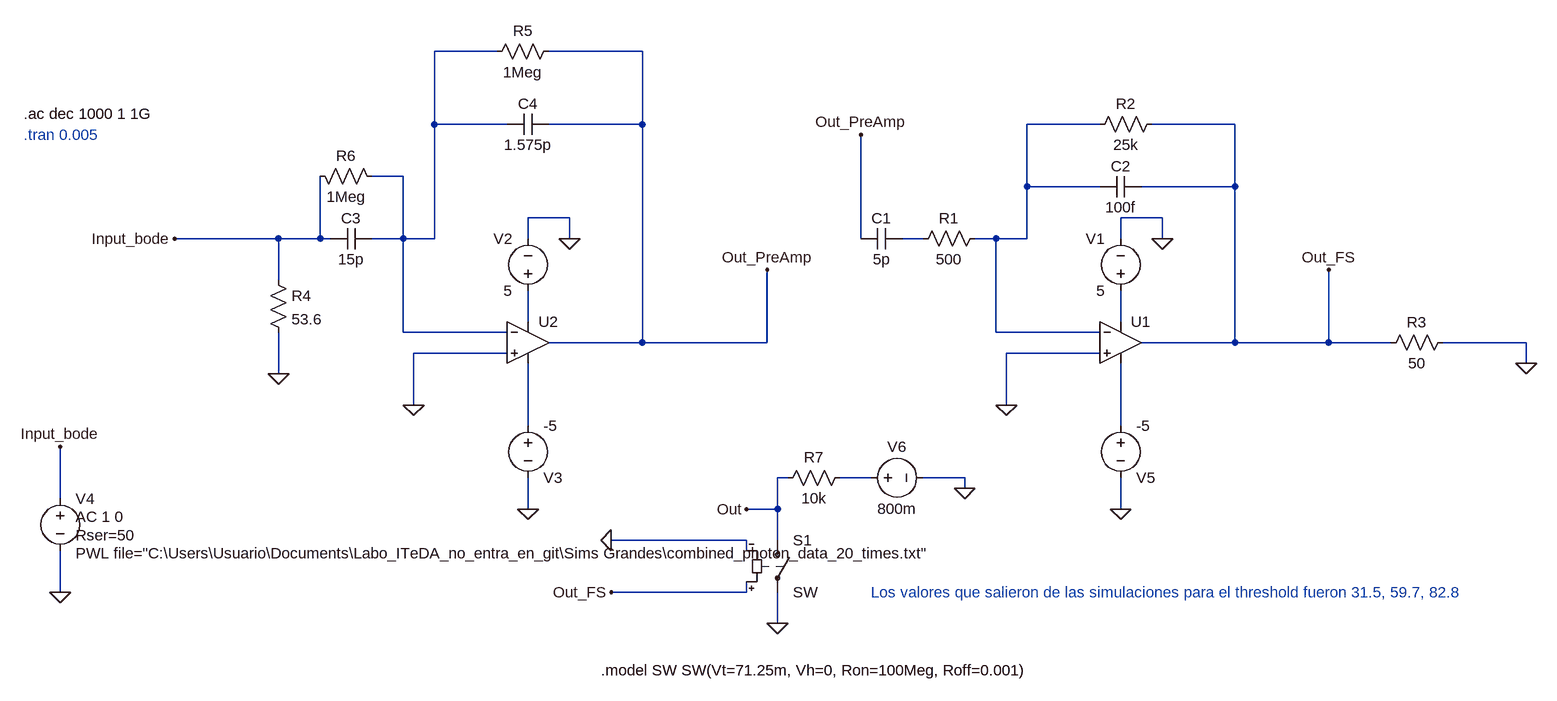
[diagram p0: schematic bode_circuito_completo_con_capacitores_en_preamp_inversor_v1,5.asc]
bode_circuito_completo_con_capacitores_en_preamp_inversor_v1,5.asc, the LTspice schematic file:
Version 4
SHEET 1 1796 904
WIRE -336 -64 -432 -64
WIRE -112 -64 -256 -64
WIRE -432 48 -432 -64
WIRE -320 48 -432 48
WIRE -112 48 -112 -64
WIRE -112 48 -256 48
WIRE 592 48 480 48
WIRE 800 48 672 48
WIRE -480 128 -528 128
WIRE 480 144 480 48
WIRE 592 144 480 144
WIRE 800 144 800 48
WIRE 800 144 656 144
WIRE -224 192 -288 192
WIRE 688 192 624 192
WIRE -672 224 -832 224
WIRE -608 224 -608 128
WIRE -608 224 -672 224
WIRE -592 224 -608 224
WIRE -480 224 -480 128
WIRE -480 224 -528 224
WIRE -432 224 -432 48
WIRE -432 224 -480 224
WIRE -288 224 -288 192
WIRE -224 224 -224 192
WIRE 224 224 224 64
WIRE 320 224 288 224
WIRE 432 224 400 224
WIRE 480 224 480 144
WIRE 480 224 432 224
WIRE 624 224 624 192
WIRE 688 224 688 192
WIRE -672 288 -672 224
WIRE -288 352 -288 304
WIRE 624 352 624 304
WIRE -480 368 -480 224
WIRE -320 368 -480 368
WIRE 432 368 432 224
WIRE 592 368 432 368
WIRE -112 384 -112 48
WIRE -112 384 -256 384
WIRE 80 384 80 272
WIRE 80 384 -112 384
WIRE 800 384 800 144
WIRE 800 384 656 384
WIRE 944 384 944 272
WIRE 944 384 800 384
WIRE 1040 384 944 384
WIRE 1248 384 1120 384
WIRE -320 400 -464 400
WIRE 592 400 448 400
WIRE 1248 416 1248 384
WIRE -672 432 -672 368
WIRE -464 480 -464 400
WIRE 448 480 448 400
WIRE -288 512 -288 416
WIRE 624 512 624 416
WIRE 112 592 96 592
WIRE 240 592 192 592
WIRE 384 592 320 592
WIRE 384 608 384 592
WIRE -1008 624 -1008 544
WIRE -288 640 -288 592
WIRE 96 640 96 592
WIRE 96 640 48 640
WIRE 624 640 624 592
WIRE 48 688 -160 688
WIRE 96 688 96 640
WIRE 48 704 48 688
WIRE -1008 768 -1008 704
WIRE 48 768 48 752
WIRE 48 768 -160 768
WIRE 96 816 96 768
FLAG 688 224 0
FLAG 448 480 0
FLAG 944 272 Out_FS
FLAG 1248 416 0
FLAG 224 64 Out_PreAmp
FLAG -1008 768 0
FLAG -1008 544 Input_bode
FLAG -288 640 0
FLAG -224 224 0
FLAG -464 480 0
FLAG 80 272 Out_PreAmp
FLAG -832 224 Input_bode
FLAG -672 432 0
FLAG 624 640 0
FLAG 96 816 0
FLAG 384 608 0
FLAG 48 640 Out
FLAG -160 688 0
FLAG -160 768 Out_FS
SYMBOL res 416 208 R90
WINDOW 0 0 56 VBottom 2
WINDOW 3 32 56 VTop 2
SYMATTR InstName R1
SYMATTR Value 500
SYMBOL res 688 32 R90
WINDOW 0 0 56 VBottom 2
WINDOW 3 32 56 VTop 2
SYMATTR InstName R2
SYMATTR Value 25k
SYMBOL voltage 624 320 R180
WINDOW 0 24 96 Left 2
WINDOW 3 24 16 Left 2
WINDOW 123 0 0 Left 0
WINDOW 39 0 0 Left 0
SYMATTR InstName V1
SYMATTR Value 5
SYMBOL OpAmps\\UniversalOpAmp1 624 384 R0
SYMATTR InstName U1
SYMATTR Value2 Avol=1900 GBW=897.0831Meg Vos=0
SYMBOL res 1136 368 R90
WINDOW 0 0 56 VBottom 2
WINDOW 3 32 56 VTop 2
SYMATTR InstName R3
SYMATTR Value 50
SYMBOL cap 288 208 R90
WINDOW 0 0 32 VBottom 2
WINDOW 3 32 32 VTop 2
SYMATTR InstName C1
SYMATTR Value 5p
SYMBOL cap 656 128 R90
WINDOW 0 0 32 VBottom 2
WINDOW 3 32 32 VTop 2
SYMATTR InstName C2
SYMATTR Value 100f
SYMBOL voltage -288 320 R180
WINDOW 0 24 96 Left 2
WINDOW 3 24 16 Left 2
WINDOW 123 0 0 Left 0
WINDOW 39 0 0 Left 0
SYMATTR InstName V2
SYMATTR Value 5
SYMBOL voltage -288 496 R0
WINDOW 0 24 96 Left 2
WINDOW 3 24 16 Left 2
WINDOW 123 0 0 Left 0
WINDOW 39 0 0 Left 0
SYMATTR InstName V3
SYMATTR Value -5
SYMBOL OpAmps\\UniversalOpAmp1 -288 384 R0
SYMATTR InstName U2
SYMATTR Value2 Avol=1900 GBW=897.0831Meg Vos=0
SYMBOL voltage -1008 608 R0
WINDOW 123 24 44 Left 2
WINDOW 39 24 72 Left 2
WINDOW 3 24 100 Left 2
SYMATTR Value2 AC 1 0
SYMATTR SpiceLine Rser=50
SYMATTR Value PWL file="C:\Users\Usuario\Documents\Labo_ITeDA_no_entra_en_git\Sims Grandes\combined_photon_data_20_times.txt"
SYMATTR InstName V4
SYMBOL cap -528 208 R90
WINDOW 0 0 32 VBottom 2
WINDOW 3 32 32 VTop 2
SYMATTR InstName C3
SYMATTR Value 15p
SYMBOL cap -256 32 R90
WINDOW 0 0 32 VBottom 2
WINDOW 3 32 32 VTop 2
SYMATTR InstName C4
SYMATTR Value 1.575p
SYMBOL res -688 272 R0
SYMATTR InstName R4
SYMATTR Value 53.6
SYMBOL res -240 -80 R90
WINDOW 0 0 56 VBottom 2
WINDOW 3 32 56 VTop 2
SYMATTR InstName R5
SYMATTR Value 1Meg
SYMBOL res -624 112 M90
WINDOW 0 0 56 VBottom 2
WINDOW 3 32 56 VTop 2
SYMATTR InstName R6
SYMATTR Value 1Meg
SYMBOL voltage 624 496 R0
WINDOW 0 24 96 Left 2
WINDOW 3 24 16 Left 2
WINDOW 123 0 0 Left 0
WINDOW 39 0 0 Left 0
SYMATTR InstName V5
SYMATTR Value -5
SYMBOL sw 96 672 R0
SYMATTR InstName S1
SYMBOL voltage 224 592 R270
WINDOW 0 32 56 VTop 2
WINDOW 3 -32 56 VBottom 2
WINDOW 123 0 0 Left 0
WINDOW 39 0 0 Left 0
SYMATTR InstName V6
SYMATTR Value 800m
SYMBOL res 208 576 R90
WINDOW 0 0 56 VBottom 2
WINDOW 3 32 56 VTop 2
SYMATTR InstName R7
SYMATTR Value 10k
TEXT -1064 64 Left 2 ;.tran 0.005
TEXT -1064 32 Left 2 !.ac dec 1000 1 1G
TEXT -176 888 Left 2 !.model SW SW(Vt=71.25m, Vh=0, Ron=100Meg, Roff=0.001)
TEXT 240 768 Left 2 ;Los valores que salieron de las simulaciones para el threshold fueron 31.5, 59.7, 82.8

The netlist it stands for:
* bode_circuito_completo_con_capacitores_en_preamp_inversor_v1,5.asc
R1 N002 N003 500
R2 Out_FS N002 25k
V1 N005 0 5
XU1 0 N002 N005 N007 Out_FS level1 Avol=1900 GBW=897.0831Meg Vos=0 En=0 Enk=0 In=0 Ink=0 Rin=500Meg  ; pins In+ In- V+ V- OUT
R3 0 Out_FS 50
C1 N003 Out_PreAmp 5p
C2 Out_FS N002 100f
V2 N004 0 5
V3 N006 0 -5
XU2 0 N001 N004 N006 Out_PreAmp level1 Avol=1900 GBW=897.0831Meg Vos=0 En=0 Enk=0 In=0 Ink=0 Rin=500Meg  ; pins In+ In- V+ V- OUT
V4 Input_bode 0 PWL file="C:\Users\Usuario\Documents\Labo_ITeDA_no_entra_en_git\Sims Grandes\combined_photon_data_20_times.txt" AC 1 0 Rser=50
C3 N001 Input_bode 15p
C4 Out_PreAmp N001 1.575p
R4 Input_bode 0 53.6
R5 Out_PreAmp N001 1Meg
R6 Input_bode N001 1Meg
V5 N007 0 -5
S1 Out 0 Out_FS 0 SW
V6 N008 0 800m
R7 N008 Out 10k
* .tran 0.005
.ac dec 1000 1 1G
.model SW SW(Vt=71.25m, Vh=0, Ron=100Meg, Roff=0.001)
* Los valores que salieron de las simulaciones para el threshold fueron 31.5, 59.7, 82.8
.lib UniversalOpAmp1.lib
.backanno
.end